# Altium schematic sheet Panel.SchDoc
size A4
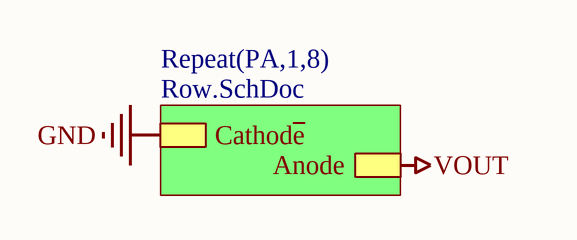
[diagram p0: Panel.SchDoc]

## Sub-sheets
Repeat(PA,1,8) = Row.SchDoc: Cathod~{e}, Anode

## Nets
GND: sheet Repeat(PA,1,8)/Cathod~{e}
VOUT: sheet Repeat(PA,1,8)/Anode